# Altium schematic sheet WIFI_BT.SchDoc
size D
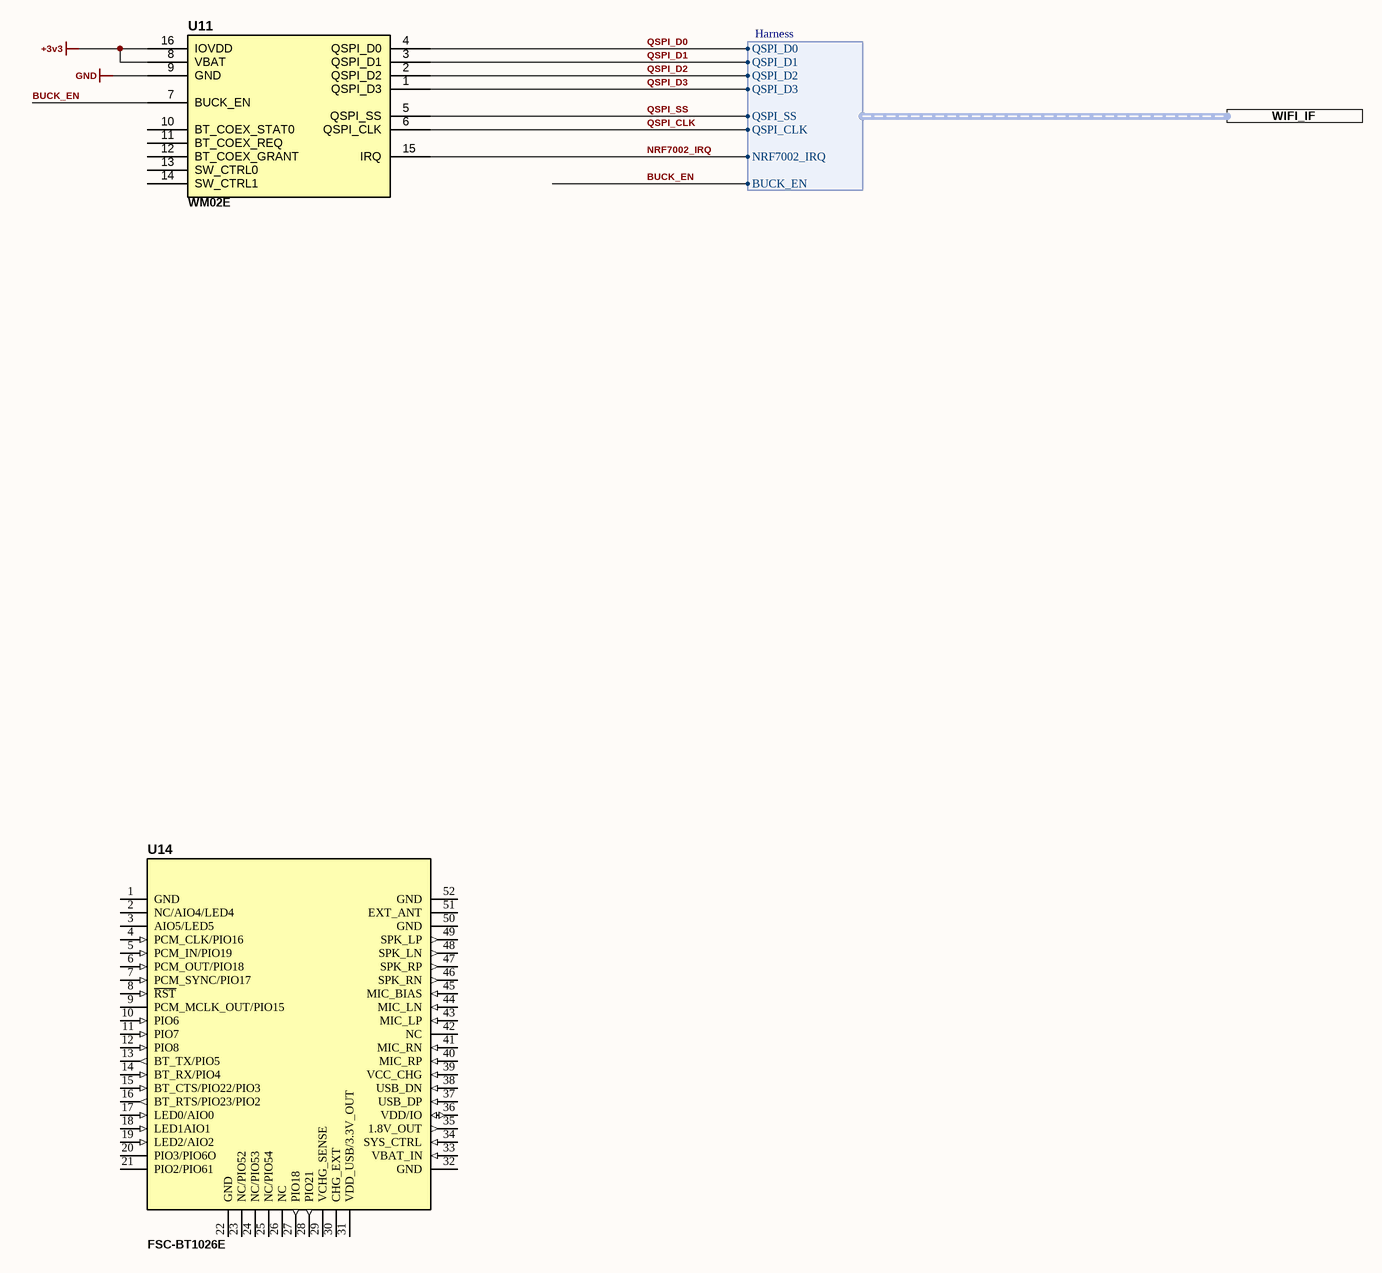
[diagram p0: WIFI_BT.SchDoc]

## Parts
U11  WM02E  [WM02E]
U14  FSC-BT1026E  [FSC-BT1026x]

## Ports
WIFI_IF (harness Harness)

## Harnesses
Harness: QSPI_D0, QSPI_D1, QSPI_D2, QSPI_D3, QSPI_SS, QSPI_CLK, NRF7002_IRQ, BUCK_EN

## Nets
+3v3: U11.8(VBAT) U11.16(IOVDD)
GND: U11.9(GND)
BUCK_EN: U11.7(BUCK_EN) ; port WIFI_IF.BUCK_EN
NRF7002_IRQ: U11.15(IRQ) ; port WIFI_IF.NRF7002_IRQ
QSPI_CLK: U11.6(QSPI_CLK) ; port WIFI_IF.QSPI_CLK
QSPI_D0: U11.4(QSPI_D0) ; port WIFI_IF.QSPI_D0
QSPI_D1: U11.3(QSPI_D1) ; port WIFI_IF.QSPI_D1
QSPI_D2: U11.2(QSPI_D2) ; port WIFI_IF.QSPI_D2
QSPI_D3: U11.1(QSPI_D3) ; port WIFI_IF.QSPI_D3
QSPI_SS: U11.5(QSPI_SS) ; port WIFI_IF.QSPI_SS

Not connected (* = marked no-connect by the designer): U11 10(BT_COEX_STAT0) 11(BT_COEX_REQ) 12(BT_COEX_GRANT) 13(SW_CTRL0) 14(SW_CTRL1); U14 1(GND) 2(NC/AIO4/LED4) 3(AIO5/LED5) 4(PCM_CLK/PIO16) 5(PCM_IN/PIO19) 6(PCM_OUT/PIO18) 7(PCM_SYNC/PIO17) 8(~{RST}) 9(PCM_MCLK_OUT/PIO15) 10(PIO6) 11(PIO7) 12(PIO8) 13(BT_TX/PIO5) 14(BT_RX/PIO4) 15(BT_CTS/PIO22/PIO3) 16(BT_RTS/PIO23/PIO2) 17(LED0/AIO0) 18(LED1AIO1) 19(LED2/AIO2) 20(PIO3/PIO6O) 21(PIO2/PIO61) 22(GND) 23(NC/PIO52) 24(NC/PIO53) 25(NC/PIO54) 26(NC) 27(PIO18) 28(PIO21) 29(VCHG_SENSE) 30(CHG_EXT) 31(VDD_USB/3.3V_OUT) 32(GND) 33(VBAT_IN) 34(SYS_CTRL) 35(1.8V_OUT) 36(VDD/IO) 37(USB_DP) 38(USB_DN) 39(VCC_CHG) 40(MIC_RP) 41(MIC_RN) 42(NC) 43(MIC_LP) 44(MIC_LN) 45(MIC_BIAS) 46(SPK_RN) 47(SPK_RP) 48(SPK_LN) 49(SPK_LP) 50(GND) 51(EXT_ANT) 52(GND)

## Notes on the sheet
- PCB REV
- CCA REV
- Sheet
- of

## Library data of the parts
U11 = WM02E: NRF7002 Module; Manufacturer: Fanstel; Value: WM02E; Substitution Notes: *
U14 = FSC-BT1026E: Bluetooth 5.1 dual mode audio module; Manufacturer: FEASYCOM; Check_prices: https://www.feasycom.com/qcc3024-bluetooth-stero-audio-module; Website Link: https://www.feasycom.com/qcc3024-bluetooth-stero-audio-module; Price: https://www.feasycom.com/qcc3024-bluetooth-stero-audio-module; Availability: In Stock; Value: FSC-BT1026E; Purchase-URL: https://www.feasycom.com/qcc3024-bluetooth-stero-audio-module; Package: QCC3024; Manufacturer Part Number: FSC-BT1026E